# Altium project Jahwa_2.PrjPcb
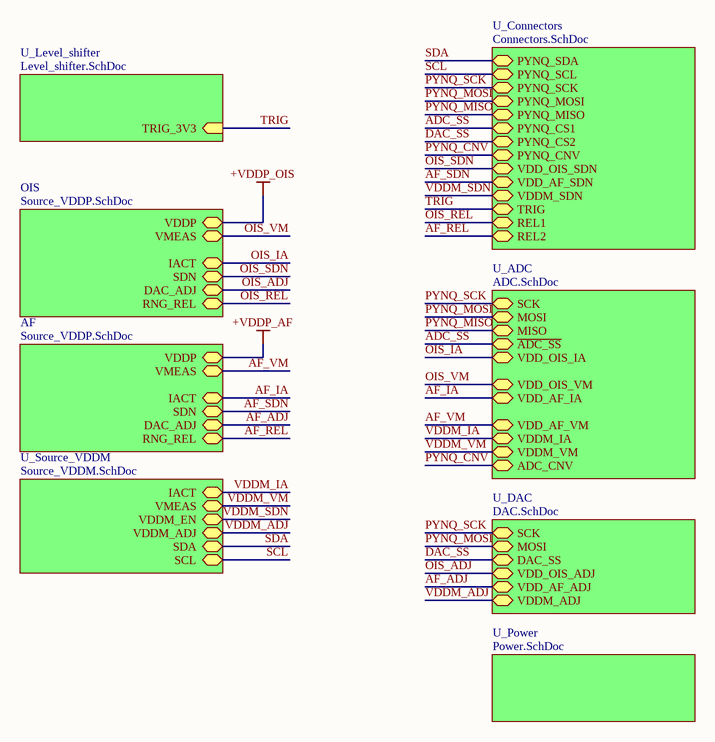
[diagram p0: Top.SchDoc]
4 sheets, 26 parts. Net scope: hierarchical (ports join the sheet entries above them; power ports are global).
Board file: PCB.PcbDoc
Sheets:
  Top.SchDoc
    U_DAC = DAC.SchDoc
    U_Connectors = Connectors.SchDoc
    U_Level_shifter = Level_shifter.SchDoc

## Sheet Top.SchDoc
size A; SheetNumber: 1; SheetTotal: 8

### Sub-sheets
AF = Source_VDDP.SchDoc (file not in this document): DAC_ADJ (bidir), SDN (bidir), IACT (bidir), VMEAS (bidir), VDDP (bidir), RNG_REL (bidir)
OIS = Source_VDDP.SchDoc (file not in this document): DAC_ADJ (bidir), SDN (bidir), IACT (bidir), VMEAS (bidir), VDDP (bidir), RNG_REL (bidir)
U_ADC = ADC.SchDoc (file not in this document): VDD_OIS_IA (bidir), SCK (bidir), MOSI (bidir), MISO (bidir), ~{ADC_SS} (bidir), VDD_OIS_VM (bidir), VDD_AF_IA (bidir), VDD_AF_VM (bidir), VDDM_IA (bidir), VDDM_VM (bidir), ADC_CNV (bidir)
U_Connectors = Connectors.SchDoc: PYNQ_SDA (bidir), PYNQ_SCL (bidir), PYNQ_SCK (bidir), PYNQ_MOSI (bidir), PYNQ_MISO (bidir), PYNQ_CS1 (bidir), PYNQ_CS2 (bidir), PYNQ_CNV (bidir), VDD_OIS_SDN (bidir), VDD_AF_SDN (bidir), VDDM_SDN (bidir), TRIG (bidir), REL2 (bidir), REL1 (bidir)
U_DAC = DAC.SchDoc: SCK (bidir), MOSI (bidir), DAC_SS (bidir), VDD_AF_ADJ (bidir), VDDM_ADJ (bidir), VDD_OIS_ADJ (bidir)
U_Level_shifter = Level_shifter.SchDoc: TRIG_3V3 (in)
U_Power = Power.SchDoc (file not in this document): no entries
U_Source_VDDM = Source_VDDM.SchDoc (file not in this document): SCL (bidir), SDA (bidir), VDDM_ADJ (bidir), VDDM_EN (bidir), VMEAS (bidir), IACT (bidir)

### Nets
+VDDP_AF: sheet AF/VDDP
+VDDP_OIS: sheet OIS/VDDP
ADC_SS: sheet U_ADC/~{ADC_SS}, sheet U_Connectors/PYNQ_CS1
AF_ADJ: sheet AF/DAC_ADJ, sheet U_DAC/VDD_AF_ADJ
AF_IA: sheet U_ADC/VDD_AF_IA, sheet AF/IACT
AF_REL: sheet AF/RNG_REL, sheet U_Connectors/REL2
AF_SDN: sheet AF/SDN, sheet U_Connectors/VDD_AF_SDN
AF_VM: sheet U_ADC/VDD_AF_VM, sheet AF/VMEAS
DAC_SS: sheet U_DAC/DAC_SS, sheet U_Connectors/PYNQ_CS2
OIS_ADJ: sheet OIS/DAC_ADJ, sheet U_DAC/VDD_OIS_ADJ
OIS_IA: sheet U_ADC/VDD_OIS_IA, sheet OIS/IACT
OIS_REL: sheet OIS/RNG_REL, sheet U_Connectors/REL1
OIS_SDN: sheet OIS/SDN, sheet U_Connectors/VDD_OIS_SDN
OIS_VM: sheet U_ADC/VDD_OIS_VM, sheet OIS/VMEAS
PYNQ_CNV: sheet U_ADC/ADC_CNV, sheet U_Connectors/PYNQ_CNV
PYNQ_MISO: sheet U_ADC/MISO, sheet U_Connectors/PYNQ_MISO
PYNQ_MOSI: sheet U_ADC/MOSI, sheet U_DAC/MOSI, sheet U_Connectors/PYNQ_MOSI
PYNQ_SCK: sheet U_ADC/SCK, sheet U_DAC/SCK, sheet U_Connectors/PYNQ_SCK
SCL: sheet U_Source_VDDM/SCL, sheet U_Connectors/PYNQ_SCL  [project net PYNQ_SCL]
SDA: sheet U_Source_VDDM/SDA, sheet U_Connectors/PYNQ_SDA  [project net PYNQ_SDA]
TRIG: sheet U_Connectors/TRIG, sheet U_Level_shifter/TRIG_3V3
VDDM_ADJ: sheet U_DAC/VDDM_ADJ, sheet U_Source_VDDM/VDDM_ADJ
VDDM_IA: sheet U_ADC/VDDM_IA, sheet U_Source_VDDM/IACT
VDDM_SDN: sheet U_Source_VDDM/VDDM_EN, sheet U_Connectors/VDDM_SDN  [project net PYNQ_SDN3]
VDDM_VM: sheet U_ADC/VDDM_VM, sheet U_Source_VDDM/VMEAS

## Sheet DAC.SchDoc
size A4; SheetNumber: 6; SheetTotal: 8
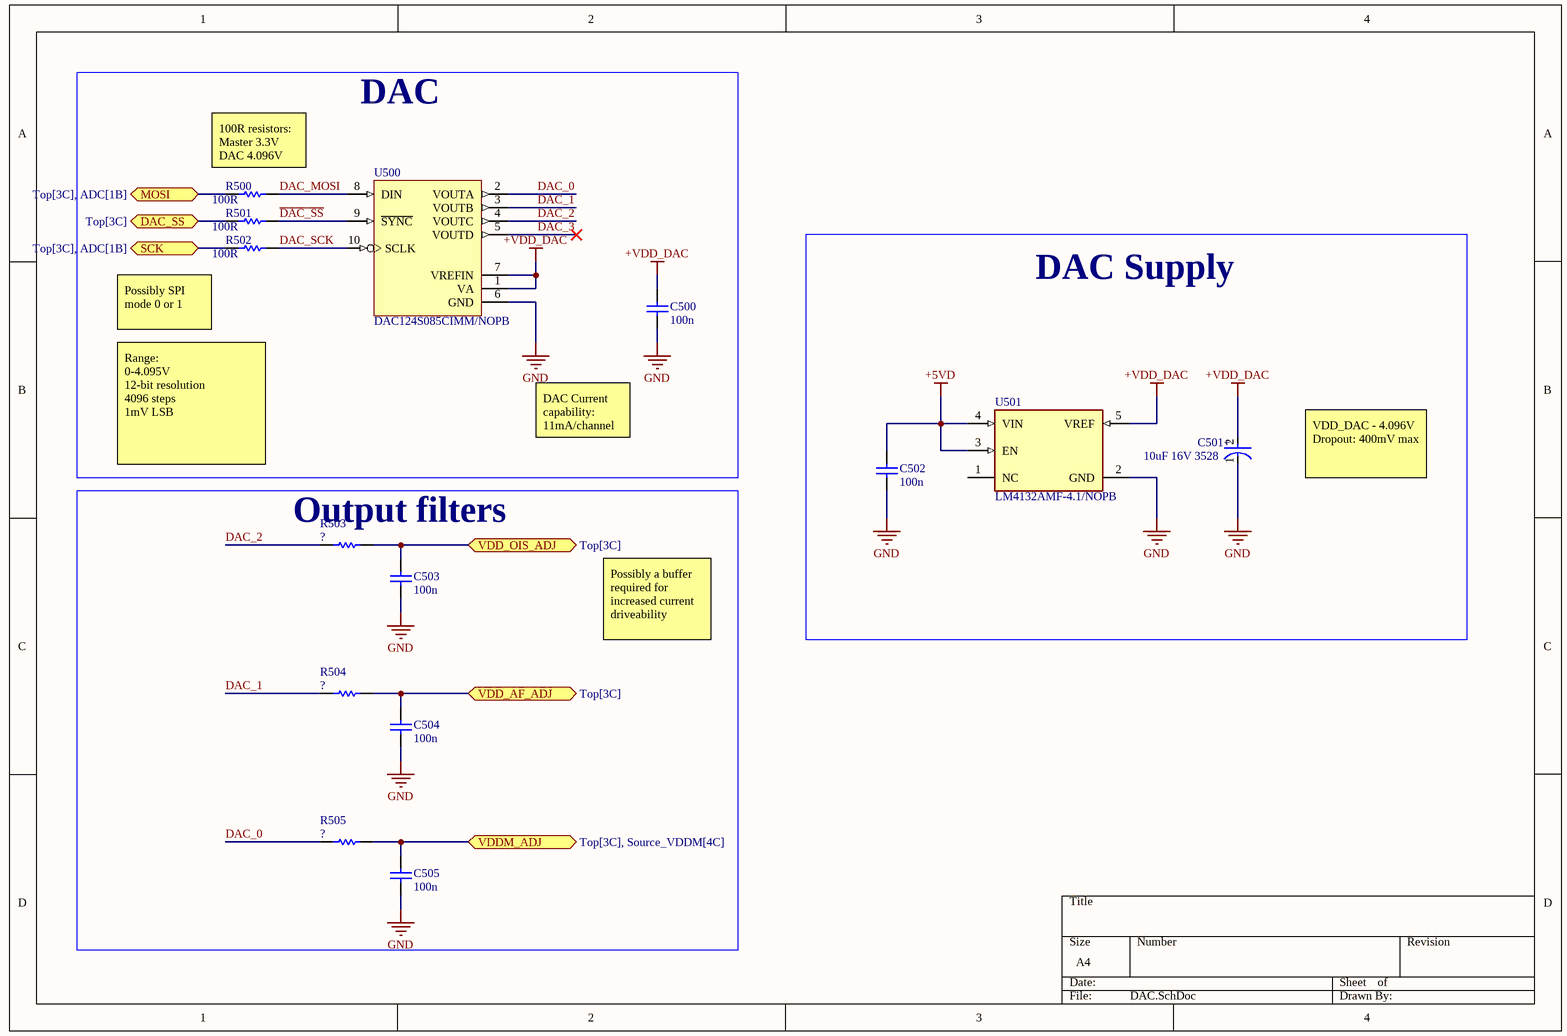
[diagram p1: DAC.SchDoc]

### Parts
C500  100n  [SAMS-C0603-2_M]
C501  10uF 16V 3528  [FP-T491B106K020AT-MFG]
C502  100n  [SAMS-C0603-2_M]
C503  100n  [SAMS-C0603-2_M]
C504  100n  [SAMS-C0603-2_M]
C505  100n  [SAMS-C0603-2_M]
R500  100R  [RESC1608X55X30ML15T15]
R501  100R  [RESC1608X55X30ML15T15]
R502  100R  [RESC1608X55X30ML15T15]
R503  ?  [RESC1608X55X30ML15T15]
R504  ?  [RESC1608X55X30ML15T15]
R505  ?  [RESC1608X55X30ML15T15]
U500  DAC124S085CIMM/NOPB  [MUB10A_L]
U501  LM4132AMF-4.1/NOPB  [FP-DBV0005A-IPC_C]

### Blocks framed on the sheet
DAC: C500 R500-R502 U500
DAC Supply: C501 C502 U501
Output filters: C503-C505 R503-R505

### Ports
DAC_SS (bidir, see Top[3C]), MOSI (bidir, see Top[3C], ADC[1B]), SCK (bidir, see Top[3C], ADC[1B]), VDD_AF_ADJ (bidir, see Top[3C]), VDD_OIS_ADJ (bidir, see Top[3C]), VDDM_ADJ (bidir, see Top[3C], Source_VDDM[4C])

### Nets
+5VD: C502.2 U501.3(EN) U501.4(VIN)
+VDD_DAC: C500.2 C501.2(A) U500.1(VA) U500.7(VREFIN) U501.5(VREF)
GND: C500.1 C501.1(C) C502.1 C503.1 C504.1 C505.1 U500.6(GND) U501.2(GND)
AF_ADJ: C504.2 R504.2 ; port VDD_AF_ADJ
~{DAC_SS}: R501.2 U500.9(~{SYNC})
DAC_0: R505.1 U500.2(VOUTA)
DAC_1: R504.1 U500.3(VOUTB)
DAC_2: R503.1 U500.4(VOUTC)
DAC_3: U500.5(VOUTD)
DAC_MOSI: R500.2 U500.8(DIN)
DAC_SCK: R502.2 U500.10(SCLK)
DAC_SS: R501.1 ; port DAC_SS
OIS_ADJ: C503.2 R503.2 ; port VDD_OIS_ADJ
PYNQ_MOSI: R500.1 ; port MOSI
PYNQ_SCK: R502.1 ; port SCK
VDDM_ADJ: C505.2 R505.2 ; port VDDM_ADJ

Not connected (* = marked no-connect by the designer): U501 1(NC)

### Notes on the sheet
- (near R500) 100R resistors:
  Master 3.3V
  DAC 4.096V
- Possibly SPI mode 0 or 1
- DAC Current capability: 11mA/channel
- Range:
  0-4.095V
  12-bit resolution
  4096 steps
  1mV LSB
- VDD_DAC - 4.096V
  Dropout: 400mV max
- Possibly a buffer required for increased current driveability
- (in symbol CMP-2000-07191-2) +

### Library data of the parts
C500 C502-C505 = CMP-2000-05332-1: Multi-layer Ceramic Capacitor, -55 to 125 degC, 2-Pin SMD (0603), RoHS, Tape and Reel; Manufacturer: Samsung Electro-Mechanics; Capacitance: 0.1µF; Rated Voltage: 50V; Dielectric: X7R; Tolerance (%): ±10%; Case Size/Dimension: 0603; Datasheet URL: https://datasheet.ciiva.com/29198/456651-da-01-en-vs-kondensator-0605-29198839.pdf; Manufacturer URL: http://www.samsungsem.com/global/index.jsp; Datasheet Version: Nov-10
C501 = CMP-2000-07191-2: CAP TANT 10UF 10% 20V 1411; Polarity: Polar; Life (Hours): 2000Hour; Dissipation Factor: 6%; Leakage Current: 2uA; Dielectric Material: Tantalum; Ripple Current: 201mA; ESR (Equivalent Series Resistance): 2.1R; Weight: 0.002293oz; Max Operating Temperature: 125°C; Failure Rate: 0.001%; Tolerance: 10%; Case Code (Metric): 3528; Case Code (Imperial): 1411; Number of Pins: 2; Case/Package: 1411; Width: 2.8mm; Height: 1.9mm; Voltage Rating: 20V; Voltage: 20V; Lead Free: Lead Free; Features: General Purpose; Radiation Hardening: No; Min Operating Temperature: -55°C; Length: 3.5mm; Mount: Surface Mount; Depth: 2.8mm; Voltage Rating (DC): 20V; Termination: SMD/SMT; Package Quantity: 1; Capacitance: 10uF; Packaging: Tape and Reel; RoHS Compliant: Yes; REACH SVHC: No SVHC; Height - Seated (Max): 0.083inch
R500-R505 = CMP-2000-00179-1: Manufacturer: Panasonic; Part Number: ERJ-3EKF1000V
U500 = CMP-0061-00134-2: 12-Bit Micro Power QUAD Digital-to-Analog Converter with Rail-to-Rail Output, 10-pin Mini SOIC, Pb-Free; Manufacturer: National Semiconductor; CompType: D/A Converter; PackageTopMarking: ZXTT*X66C; PowerWise: Y; RoHS: Y; ComponentLink1Description: DAC124S085 Datasheet; ComponentLink3Description: MUB10A Package Page; ComponentLink2URL: http://www.national.com/pf/DA/DAC124S085.html; ComponentLink3URL: http://www.national.com/packaging/folders/mub10a.html; PackageDescription: Mini-SO, Molded, .118 x .118 x .034in Body, 10 Lead, .0197in Pitch; PackageReference: MUB10A; ComponentLink2Description: DAC124S085 Web Page; RevisionNote: Component URLs added; Code_JEDEC: MO-187-BA; PinCount: 10; DatasheetVersion: Nov-2008; ComponentLink1URL: http://www.national.com/ds/DA/DAC124S085.pdf; PackageVersion: revB, Jul-2003
U501 = CMP-04916-000024-1: IC VREF SERIES 0.05% SOT23-5; Quiescent Current: 60uA; Max Power Dissipation: 350mW; Reference Voltage: 4.096V; Min Input Voltage: 2.2V; Temperature Coefficient: 10ppm/°C; Max Input Voltage: 6V; Dropout Voltage: 175mV; Max Output Current: 20mA; Number of Pins: 5; Radiation Hardening: No; Series: LM4132; REACH SVHC: No SVHC; Package Quantity: 1000; Height: 1.02mm; Max Operating Temperature: 125°C; Reference Type: Series; Max Output Voltage: 4.096V; Packaging: Tape and Reel; Tolerance: 0.05%; Length: 2.92mm; Min Operating Temperature: -40°C; Nominal Supply Current: 60uA; RoHS Compliant: Yes; Case/Package: SOT-23; Output Voltage: 4.096V; Lead Free: Lead Free; Width: 1.6mm; Output Current: 20mA; Supply Current: 60uA; Termination: SMD/SMT; Mount: Surface Mount

## Sheet Connectors.SchDoc
size A4; SheetNumber: 8; SheetTotal: 8
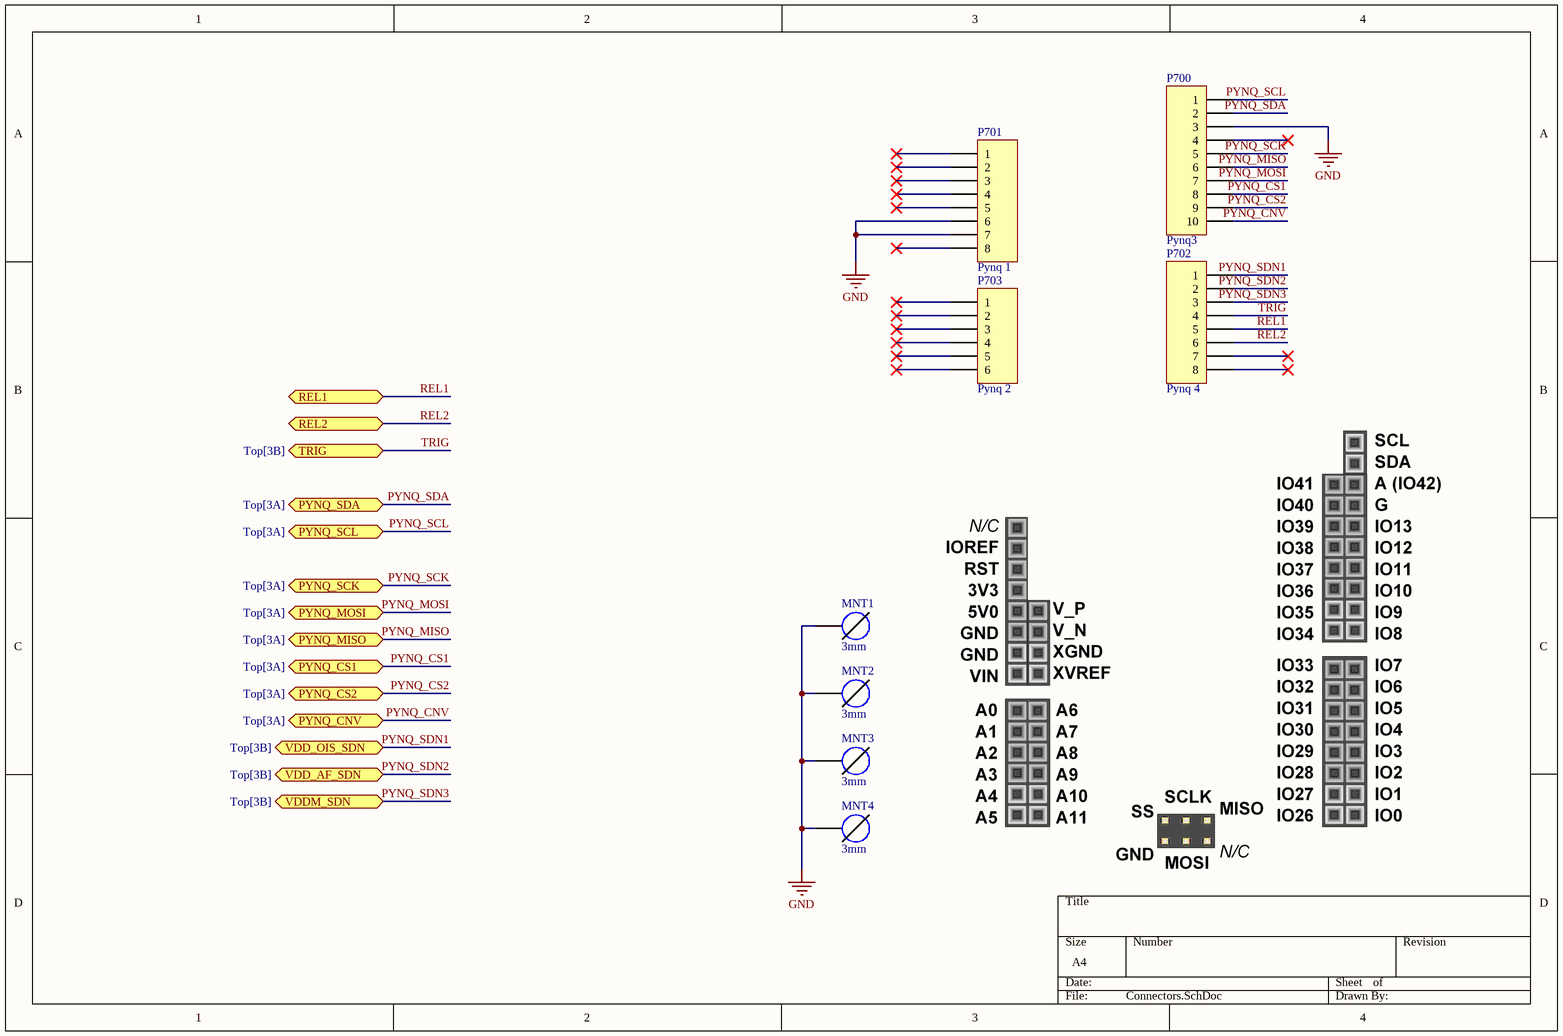
[diagram p2: Connectors.SchDoc]

### Parts
MNT1  3mm  [3mm Hole]
MNT2  3mm  [3mm Hole]
MNT3  3mm  [3mm Hole]
MNT4  3mm  [3mm Hole]
P700  Pynq3  [HDR1X10]
P701  Pynq 1  [HDR1X8]
P702  Pynq 4  [HDR1X8]
P703  Pynq 2  [HDR1X6]

### Ports
PYNQ_CNV (bidir, see Top[3A]), PYNQ_CS1 (bidir, see Top[3A]), PYNQ_CS2 (bidir, see Top[3A]), PYNQ_MISO (bidir, see Top[3A]), PYNQ_MOSI (bidir, see Top[3A]), PYNQ_SCK (bidir, see Top[3A]), PYNQ_SCL (bidir, see Top[3A]), PYNQ_SDA (bidir, see Top[3A]), REL1 (bidir), REL2 (bidir), TRIG (bidir, see Top[3B]), VDD_AF_SDN (bidir, see Top[3B]), VDD_OIS_SDN (bidir, see Top[3B]), VDDM_SDN (bidir, see Top[3B])

### Nets
GND: MNT1.1 MNT2.1 MNT3.1 MNT4.1 P700.3 P701.6 P701.7
PYNQ_CNV: P700.10 ; port PYNQ_CNV
PYNQ_CS1: P700.8 ; port PYNQ_CS1  [project net ADC_SS]
PYNQ_CS2: P700.9 ; port PYNQ_CS2  [project net DAC_SS]
PYNQ_MISO: P700.6 ; port PYNQ_MISO
PYNQ_MOSI: P700.7 ; port PYNQ_MOSI
PYNQ_SCK: P700.5 ; port PYNQ_SCK
PYNQ_SCL: P700.1 ; port PYNQ_SCL
PYNQ_SDA: P700.2 ; port PYNQ_SDA
PYNQ_SDN1: P702.1 ; port VDD_OIS_SDN  [project net OIS_SDN]
PYNQ_SDN2: P702.2 ; port VDD_AF_SDN  [project net AF_SDN]
PYNQ_SDN3: P702.3 ; port VDDM_SDN
REL1: P702.5 ; port REL1  [project net OIS_REL]
REL2: P702.6 ; port REL2  [project net AF_REL]
TRIG: P702.4 ; port TRIG

Not connected (* = marked no-connect by the designer): P700 4*; P701 1* 2* 3* 4* 5* 8*; P702 7* 8*; P703 1* 2* 3* 4* 5* 6*

### Library data of the parts
MNT1-MNT4 = Hole 3mm
P700 = Header 10: Header, 10-Pin; LatestRevisionDate: 17-Jul-2002; LatestRevisionNote: Re-released for DXP Platform.; Publisher: Altium Limited
P701 P702 = Header 8: Header, 8-Pin; LatestRevisionDate: 17-Jul-2002; LatestRevisionNote: Re-released for DXP Platform.; Publisher: Altium Limited
P703 = Header 6: Header, 6-Pin; LatestRevisionDate: 17-Jul-2002; LatestRevisionNote: Re-released for DXP Platform.; Publisher: Altium Limited

## Sheet Level_shifter.SchDoc
size A4; SheetNumber: 7; SheetTotal: 8
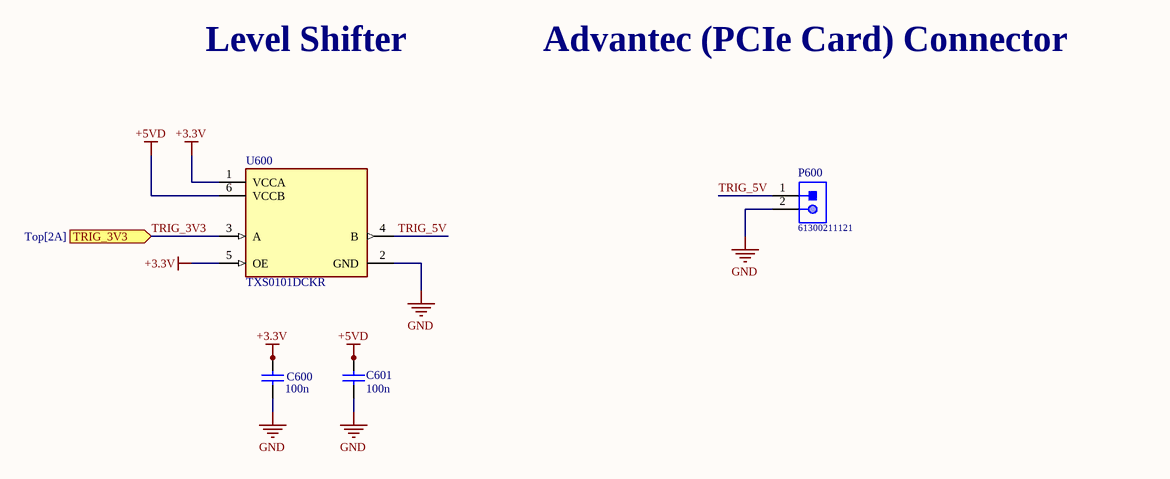
[diagram p3: Level_shifter.SchDoc]

### Parts
C600  100n  [SAMS-C0603-2_M]
C601  100n  [SAMS-C0603-2_M]
P600  61300211121  [61300211121]
U600  TXS0101DCKR  [FP-DCK0006A-MFG]

### Ports
TRIG_3V3 (in, see Top[2A])

### Nets
+3.3V: C600.2 U600.1(VCCA) U600.5(OE)
+5VD: C601.2 U600.6(VCCB)
GND: C600.1 C601.1 P600.2 U600.2(GND)
TRIG_3V3: U600.3(A) ; port TRIG_3V3  [project net TRIG]
TRIG_5V: P600.1 U600.4(B)

### Notes on the sheet
- Level Shifter
- Advantec (PCIe Card) Connector

### Library data of the parts
C600 C601 = CMP-2000-05332-1: as C500 on sheet DAC; Case Size/Dimension: 0603; Datasheet URL: https://datasheet.ciiva.com/29198/456651-da-01-en-vs-kondensator-0605-29198839.pdf; Manufacturer URL: http://www.samsungsem.com/global/index.jsp; Datasheet Version: Nov-10
P600 = CMP-1712-00002-4: THT Vertical Pin Header WR-PHD, Pitch 2.54 mm, Single Row, 2 pins; Manufacturer: Wurth Elektronik; Rated Current: 3A; Gender: Male; Withstanding Voltage: 500VAC; Working Voltage: 250VAC; Pitch: 2.54mm; Contact Resistance: 20mOhm; Pin Number: 2; Mounting Technology: THT; Orientation: Vertical; Operating Temperature: -40to105degC; Packaging: Bag; Publisher: WurthElektronik; Datasheet URL: https://katalog.we-online.de/em/datasheet/6130xx11121.pdf; Manufacturer URL: http://www.we-online.de; Row Number: Single; Package Reference: 61300211121; Part Number: 61300211121
U600 = CMP-04899-000067-1: IC TRNSLTR BIDIRECTIONAL SC70-6; Propagation Delay: 260ns; Number of Channels: 1; Min Supply Voltage: 1.65V; Logic Function: Translator; Output Type: Voltage; Low Level Output Current: 1mA; Data Rate: 24Mbps; Quiescent Current: 14.4uA; Max Supply Voltage: 5.5V; High Level Output Current: -20uA; Series: -; RoHS Compliant: Yes; Radiation Hardening: No; Number of Bits: 1; Min Operating Temperature: -40°C; Max Operating Temperature: 85°C; REACH SVHC: No SVHC; Lead Free: Lead Free; Number of Pins: 6; Package Quantity: 1; Turn-On Delay Time: 260ns; Mount: Surface Mount; Packaging: Tape and Reel; Number of Inputs: 1; Case/Package: SC

## Nets that join several sheets
+5VD: DAC (C502.2 U501.3 U501.4), Level_shifter (C601.2 U600.6)
GND: DAC (8 pins), Connectors (7 pins), Level_shifter (C600.1 C601.1 P600.2 U600.2)
DAC_SS: DAC (R501.1), Connectors (P700.9)
PYNQ_MOSI: DAC (R500.1), Connectors (P700.7)
PYNQ_SCK: DAC (R502.1), Connectors (P700.5)
TRIG: Connectors (P702.4), Level_shifter (U600.3)